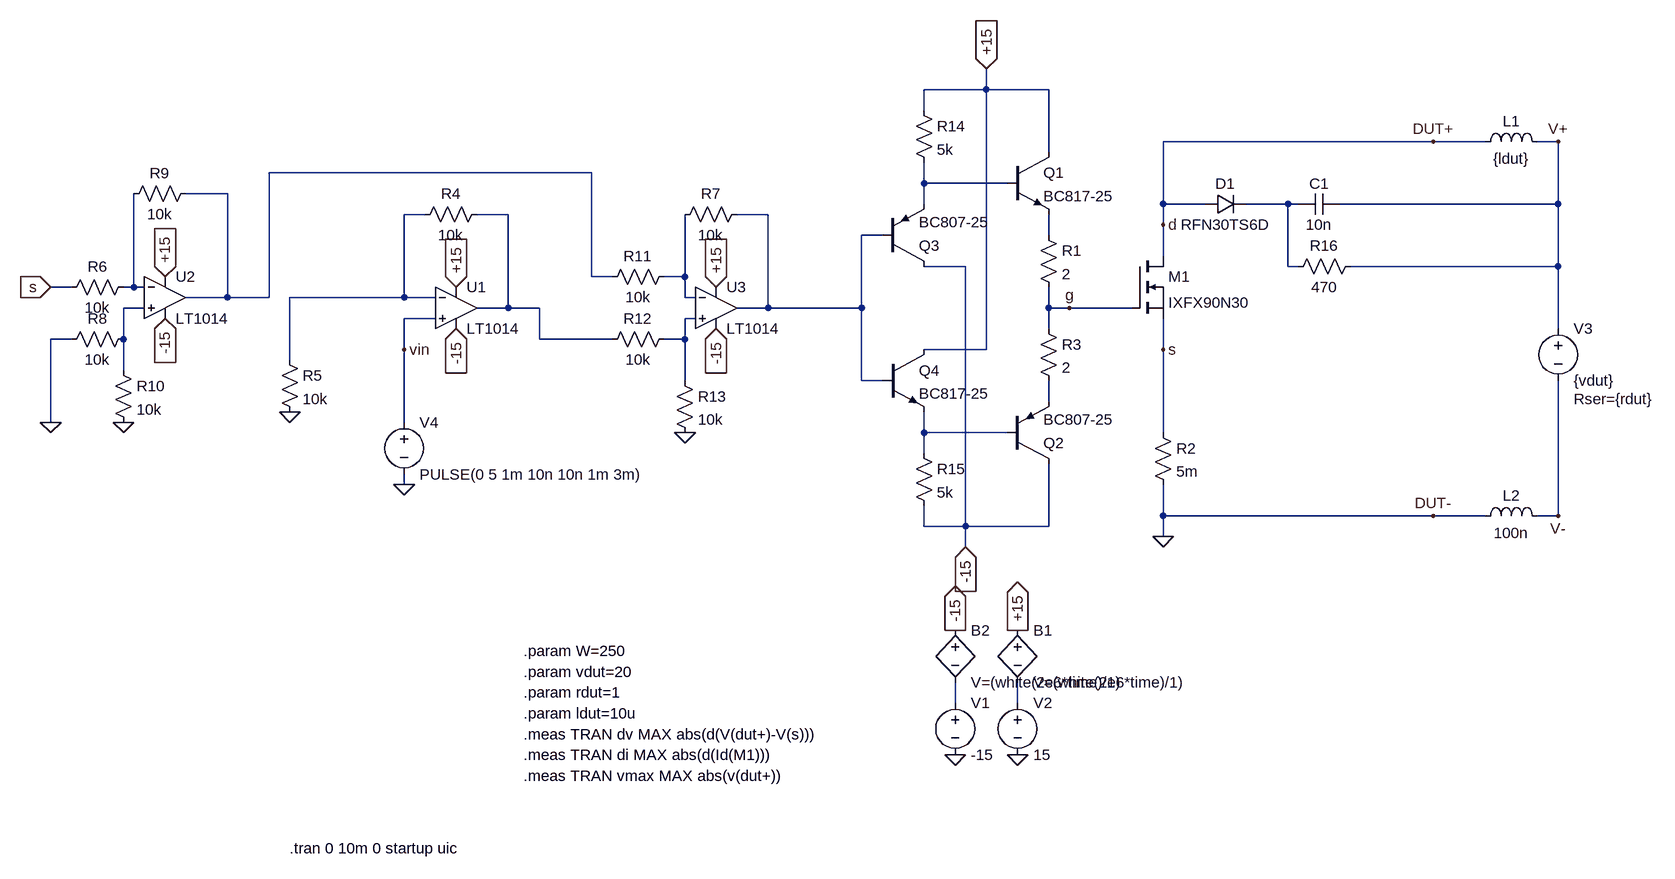
[diagram p0: schematic Load Gate.asc]
Load Gate.asc, the LTspice schematic file:
Version 4
SHEET 1 1136 1040
WIRE 80 -144 80 -176
WIRE 80 -144 -16 -144
WIRE 176 -144 80 -144
WIRE -16 -112 -16 -144
WIRE 768 -64 352 -64
WIRE 848 -64 768 -64
WIRE 960 -64 928 -64
WIRE 176 -48 176 -144
WIRE -528 -16 -1024 -16
WIRE -16 0 -16 -32
WIRE 112 0 -16 0
WIRE -1088 16 -1152 16
WIRE -16 32 -16 0
WIRE 352 32 352 -64
WIRE 416 32 352 32
WIRE 544 32 480 32
WIRE 560 32 544 32
WIRE 960 32 960 -64
WIRE 960 32 624 32
WIRE -784 48 -816 48
WIRE -656 48 -704 48
WIRE -256 48 -304 48
WIRE 352 64 352 32
WIRE -80 80 -112 80
WIRE 176 80 176 48
WIRE 352 112 352 64
WIRE 48 128 -16 128
WIRE 544 128 544 32
WIRE 560 128 544 128
WIRE 960 128 960 32
WIRE 960 128 640 128
WIRE -528 144 -528 -16
WIRE -496 144 -528 144
WIRE -384 144 -384 48
WIRE -384 144 -416 144
WIRE -1328 160 -1360 160
WIRE -1232 160 -1232 16
WIRE -1232 160 -1248 160
WIRE -1216 160 -1232 160
WIRE -1088 176 -1088 16
WIRE -1088 176 -1152 176
WIRE -1024 176 -1024 -16
WIRE -1024 176 -1088 176
WIRE -816 176 -816 48
WIRE -816 176 -992 176
WIRE -768 176 -816 176
WIRE -384 176 -384 144
WIRE -368 176 -384 176
WIRE -1216 192 -1248 192
WIRE -656 192 -656 48
WIRE -656 192 -704 192
WIRE -608 192 -656 192
WIRE -256 192 -256 48
WIRE -256 192 -304 192
WIRE -112 192 -112 80
WIRE -112 192 -256 192
WIRE 176 192 176 160
WIRE 208 192 176 192
WIRE 304 192 208 192
WIRE -768 208 -816 208
WIRE -368 208 -384 208
WIRE 176 224 176 192
WIRE 960 224 960 128
WIRE -1328 240 -1360 240
WIRE -1248 240 -1248 192
WIRE -608 240 -608 192
WIRE -496 240 -608 240
WIRE -384 240 -384 208
WIRE -384 240 -416 240
WIRE -816 256 -816 208
WIRE 80 256 80 -144
WIRE 80 256 -16 256
WIRE 352 256 352 208
WIRE -992 272 -992 176
WIRE -1248 288 -1248 240
WIRE -384 304 -384 240
WIRE -112 304 -112 192
WIRE -80 304 -112 304
WIRE 176 336 176 304
WIRE -1360 368 -1360 240
WIRE -816 368 -816 256
WIRE -16 384 -16 352
WIRE 112 384 -16 384
WIRE 352 384 352 256
WIRE -16 416 -16 384
WIRE -816 464 -816 448
WIRE 352 512 352 464
WIRE 768 512 352 512
WIRE 848 512 768 512
WIRE 960 512 960 304
WIRE 960 512 928 512
WIRE -16 528 -16 496
WIRE 48 528 48 128
WIRE 48 528 -16 528
WIRE 176 528 176 432
WIRE 176 528 48 528
WIRE 352 544 352 512
WIRE 48 560 48 528
WIRE 32 800 32 768
WIRE 128 800 128 768
FLAG 32 688 -15
IOPIN 32 688 Out
FLAG 128 688 +15
IOPIN 128 688 Out
FLAG -736 160 +15
IOPIN -736 160 In
FLAG -736 224 -15
IOPIN -736 224 In
FLAG -1184 144 +15
IOPIN -1184 144 In
FLAG -1184 208 -15
IOPIN -1184 208 In
FLAG -336 160 +15
IOPIN -336 160 In
FLAG -336 224 -15
IOPIN -336 224 In
FLAG -816 256 vin
FLAG -1248 368 0
FLAG -992 352 0
FLAG -816 464 0
FLAG -384 384 0
FLAG 128 880 0
FLAG 32 880 0
FLAG 768 -64 DUT+
FLAG 768 512 DUT-
FLAG 960 -64 V+
FLAG 960 512 V-
FLAG 352 544 0
FLAG -1360 368 0
FLAG -1360 160 s
IOPIN -1360 160 In
FLAG 352 256 s
FLAG 352 64 d
FLAG 208 192 g
FLAG 80 -176 +15
IOPIN 80 -176 In
FLAG 48 560 -15
IOPIN 48 560 In
SYMBOL nmos 304 112 R0
SYMATTR InstName M1
SYMATTR Value IXFX90N30
SYMBOL Opamps\\LT1014 -736 128 R0
SYMATTR InstName U1
SYMBOL voltage 32 784 R0
WINDOW 123 0 0 Left 0
WINDOW 39 0 0 Left 0
SYMATTR InstName V1
SYMATTR Value -15
SYMBOL voltage 128 784 R0
WINDOW 123 0 0 Left 0
WINDOW 39 0 0 Left 0
SYMATTR InstName V2
SYMATTR Value 15
SYMBOL res 336 368 R0
SYMATTR InstName R2
SYMATTR Value 5m
SYMBOL Opamps\\LT1014 -1184 112 R0
SYMATTR InstName U2
SYMBOL voltage -816 352 R0
WINDOW 123 0 0 Left 0
WINDOW 39 0 0 Left 0
SYMATTR InstName V4
SYMATTR Value PULSE(0 5 1m 10n 10n 1m 3m)
SYMBOL res -688 32 R90
WINDOW 0 0 56 VBottom 2
WINDOW 3 32 56 VTop 2
SYMATTR InstName R4
SYMATTR Value 10k
SYMBOL res -1008 256 R0
SYMATTR InstName R5
SYMATTR Value 10k
SYMBOL res -1232 144 R90
WINDOW 0 0 56 VBottom 2
WINDOW 3 32 56 VTop 2
SYMATTR InstName R6
SYMATTR Value 10k
SYMBOL res -1232 224 R90
WINDOW 0 0 56 VBottom 2
WINDOW 3 32 56 VTop 2
SYMATTR InstName R8
SYMATTR Value 10k
SYMBOL res -1136 0 R90
WINDOW 0 0 56 VBottom 2
WINDOW 3 32 56 VTop 2
SYMATTR InstName R9
SYMATTR Value 10k
SYMBOL res -1264 272 R0
SYMATTR InstName R10
SYMATTR Value 10k
SYMBOL Opamps\\LT1014 -336 128 R0
SYMATTR InstName U3
SYMBOL res -288 32 R90
WINDOW 0 0 56 VBottom 2
WINDOW 3 32 56 VTop 2
SYMATTR InstName R7
SYMATTR Value 10k
SYMBOL res -400 128 R90
WINDOW 0 0 56 VBottom 2
WINDOW 3 32 56 VTop 2
SYMATTR InstName R11
SYMATTR Value 10k
SYMBOL res -400 224 R90
WINDOW 0 0 56 VBottom 2
WINDOW 3 32 56 VTop 2
SYMATTR InstName R12
SYMATTR Value 10k
SYMBOL res -400 288 R0
SYMATTR InstName R13
SYMATTR Value 10k
SYMBOL bv 128 672 R0
SYMATTR InstName B1
SYMATTR Value V=(white(2e6*time)/1)
SYMBOL bv 32 672 R0
SYMATTR InstName B2
SYMATTR Value V=(white(2e6*time)/1)
SYMBOL voltage 960 208 R0
WINDOW 123 0 0 Left 0
WINDOW 39 24 124 Left 2
SYMATTR SpiceLine Rser={rdut}
SYMATTR InstName V3
SYMATTR Value {vdut}
SYMBOL ind 832 -48 R270
WINDOW 0 32 56 VTop 2
WINDOW 3 5 56 VBottom 2
SYMATTR InstName L1
SYMATTR Value {ldut}
SYMATTR SpiceLine Rser=10m
SYMBOL ind 832 528 R270
WINDOW 0 32 56 VTop 2
WINDOW 3 5 56 VBottom 2
SYMATTR InstName L2
SYMATTR Value 100n
SYMATTR SpiceLine Rser=10m
SYMBOL res 160 64 R0
SYMATTR InstName R1
SYMATTR Value 2
SYMBOL res 160 208 R0
SYMATTR InstName R3
SYMATTR Value 2
SYMBOL npn 112 -48 R0
SYMATTR InstName Q1
SYMATTR Value BC817-25
SYMBOL pnp 112 432 M180
SYMATTR InstName Q2
SYMATTR Value BC807-25
SYMBOL pnp -80 128 M180
SYMATTR InstName Q3
SYMATTR Value BC807-25
SYMBOL npn -80 256 R0
SYMATTR InstName Q4
SYMATTR Value BC817-25
SYMBOL res -32 -128 R0
SYMATTR InstName R14
SYMATTR Value 5k
SYMBOL res -32 400 R0
SYMATTR InstName R15
SYMATTR Value 5k
SYMBOL diode 416 48 R270
WINDOW 0 32 32 VTop 2
WINDOW 3 0 32 VBottom 2
SYMATTR InstName D1
SYMATTR Value RFN30TS6D
SYMBOL res 656 112 R90
WINDOW 0 0 56 VBottom 2
WINDOW 3 32 56 VTop 2
SYMATTR InstName R16
SYMATTR Value 470
SYMBOL cap 624 16 R90
WINDOW 0 0 32 VBottom 2
WINDOW 3 32 32 VTop 2
SYMATTR InstName C1
SYMATTR Value 10n
TEXT -632 720 Left 2 !.param W=250
TEXT -632 752 Left 2 !.param vdut=20
TEXT -632 784 Left 2 !.param rdut=1
TEXT -632 816 Left 2 !.param ldut=10u
TEXT -632 848 Left 2 !.meas TRAN dv MAX abs(d(V(dut+)-V(s)))
TEXT -632 880 Left 2 !.meas TRAN di MAX abs(d(Id(M1)))
TEXT -632 912 Left 2 !.meas TRAN vmax MAX abs(v(dut+))
TEXT -992 1024 Left 2 !.tran 0 10m 0 startup uic

The netlist it stands for:
* Load Gate.asc
M1 d g s s IXFX90N30
XU1 vin N004 +15 -15 N005 LT1014  ; pins In+ In- V+ V- OUT
V1 N014 0 -15
V2 N015 0 15
R2 s 0 5m
XU2 N010 N009 +15 -15 N001 LT1014  ; pins In+ In- V+ V- OUT
V4 vin 0 PULSE(0 5 1m 10n 10n 1m 3m)
R4 N005 N004 10k
R5 N004 0 10k
R6 N009 s 10k
R8 N010 0 10k
R9 N001 N009 10k
R10 N010 0 10k
XU3 N011 N008 +15 -15 N006 LT1014  ; pins In+ In- V+ V- OUT
R7 N006 N008 10k
R11 N008 N001 10k
R12 N011 N005 10k
R13 N011 0 10k
B1 +15 N015 V=(white(2e6*time)/1)
B2 -15 N014 V=(white(2e6*time)/1)
V3 V+ V- {vdut} Rser={rdut}
L1 d V+ {ldut} Rser=10m
L2 0 V- 100n Rser=10m
R1 N007 g 2
R3 g N012 2
Q1 +15 N002 N007 0 BC817-25
Q2 -15 N013 N012 0 BC807-25
Q3 -15 N006 N002 0 BC807-25
Q4 +15 N006 N013 0 BC817-25
R14 +15 N002 5k
R15 N013 -15 5k
D1 d N003 RFN30TS6D
R16 V+ N003 470
C1 V+ N003 10n
.model D D
.lib standard.dio
.model NPN NPN
.model PNP PNP
.lib standard.bjt
.model NMOS NMOS
.model PMOS PMOS
.lib standard.mos
.param W=250
.param vdut=20
.param rdut=1
.param ldut=10u
.meas TRAN dv MAX abs(d(V(dut+)-V(s)))
.meas TRAN di MAX abs(d(Id(M1)))
.meas TRAN vmax MAX abs(v(dut+))
.tran 0 10m 0 startup uic
.backanno
.end